# EasyEDA Pro project C题视觉追踪板子1.eprj, schematic Schematic1
Board Name: Board1; Create Date: 2025-04-08; Page Name: P1; Project Name: C题视觉追踪板子1; Schematic Name: Schematic1; Update Date: 2025-04-08; Company: 嘉立创EDA; Page Size: A4; Version: V1.0
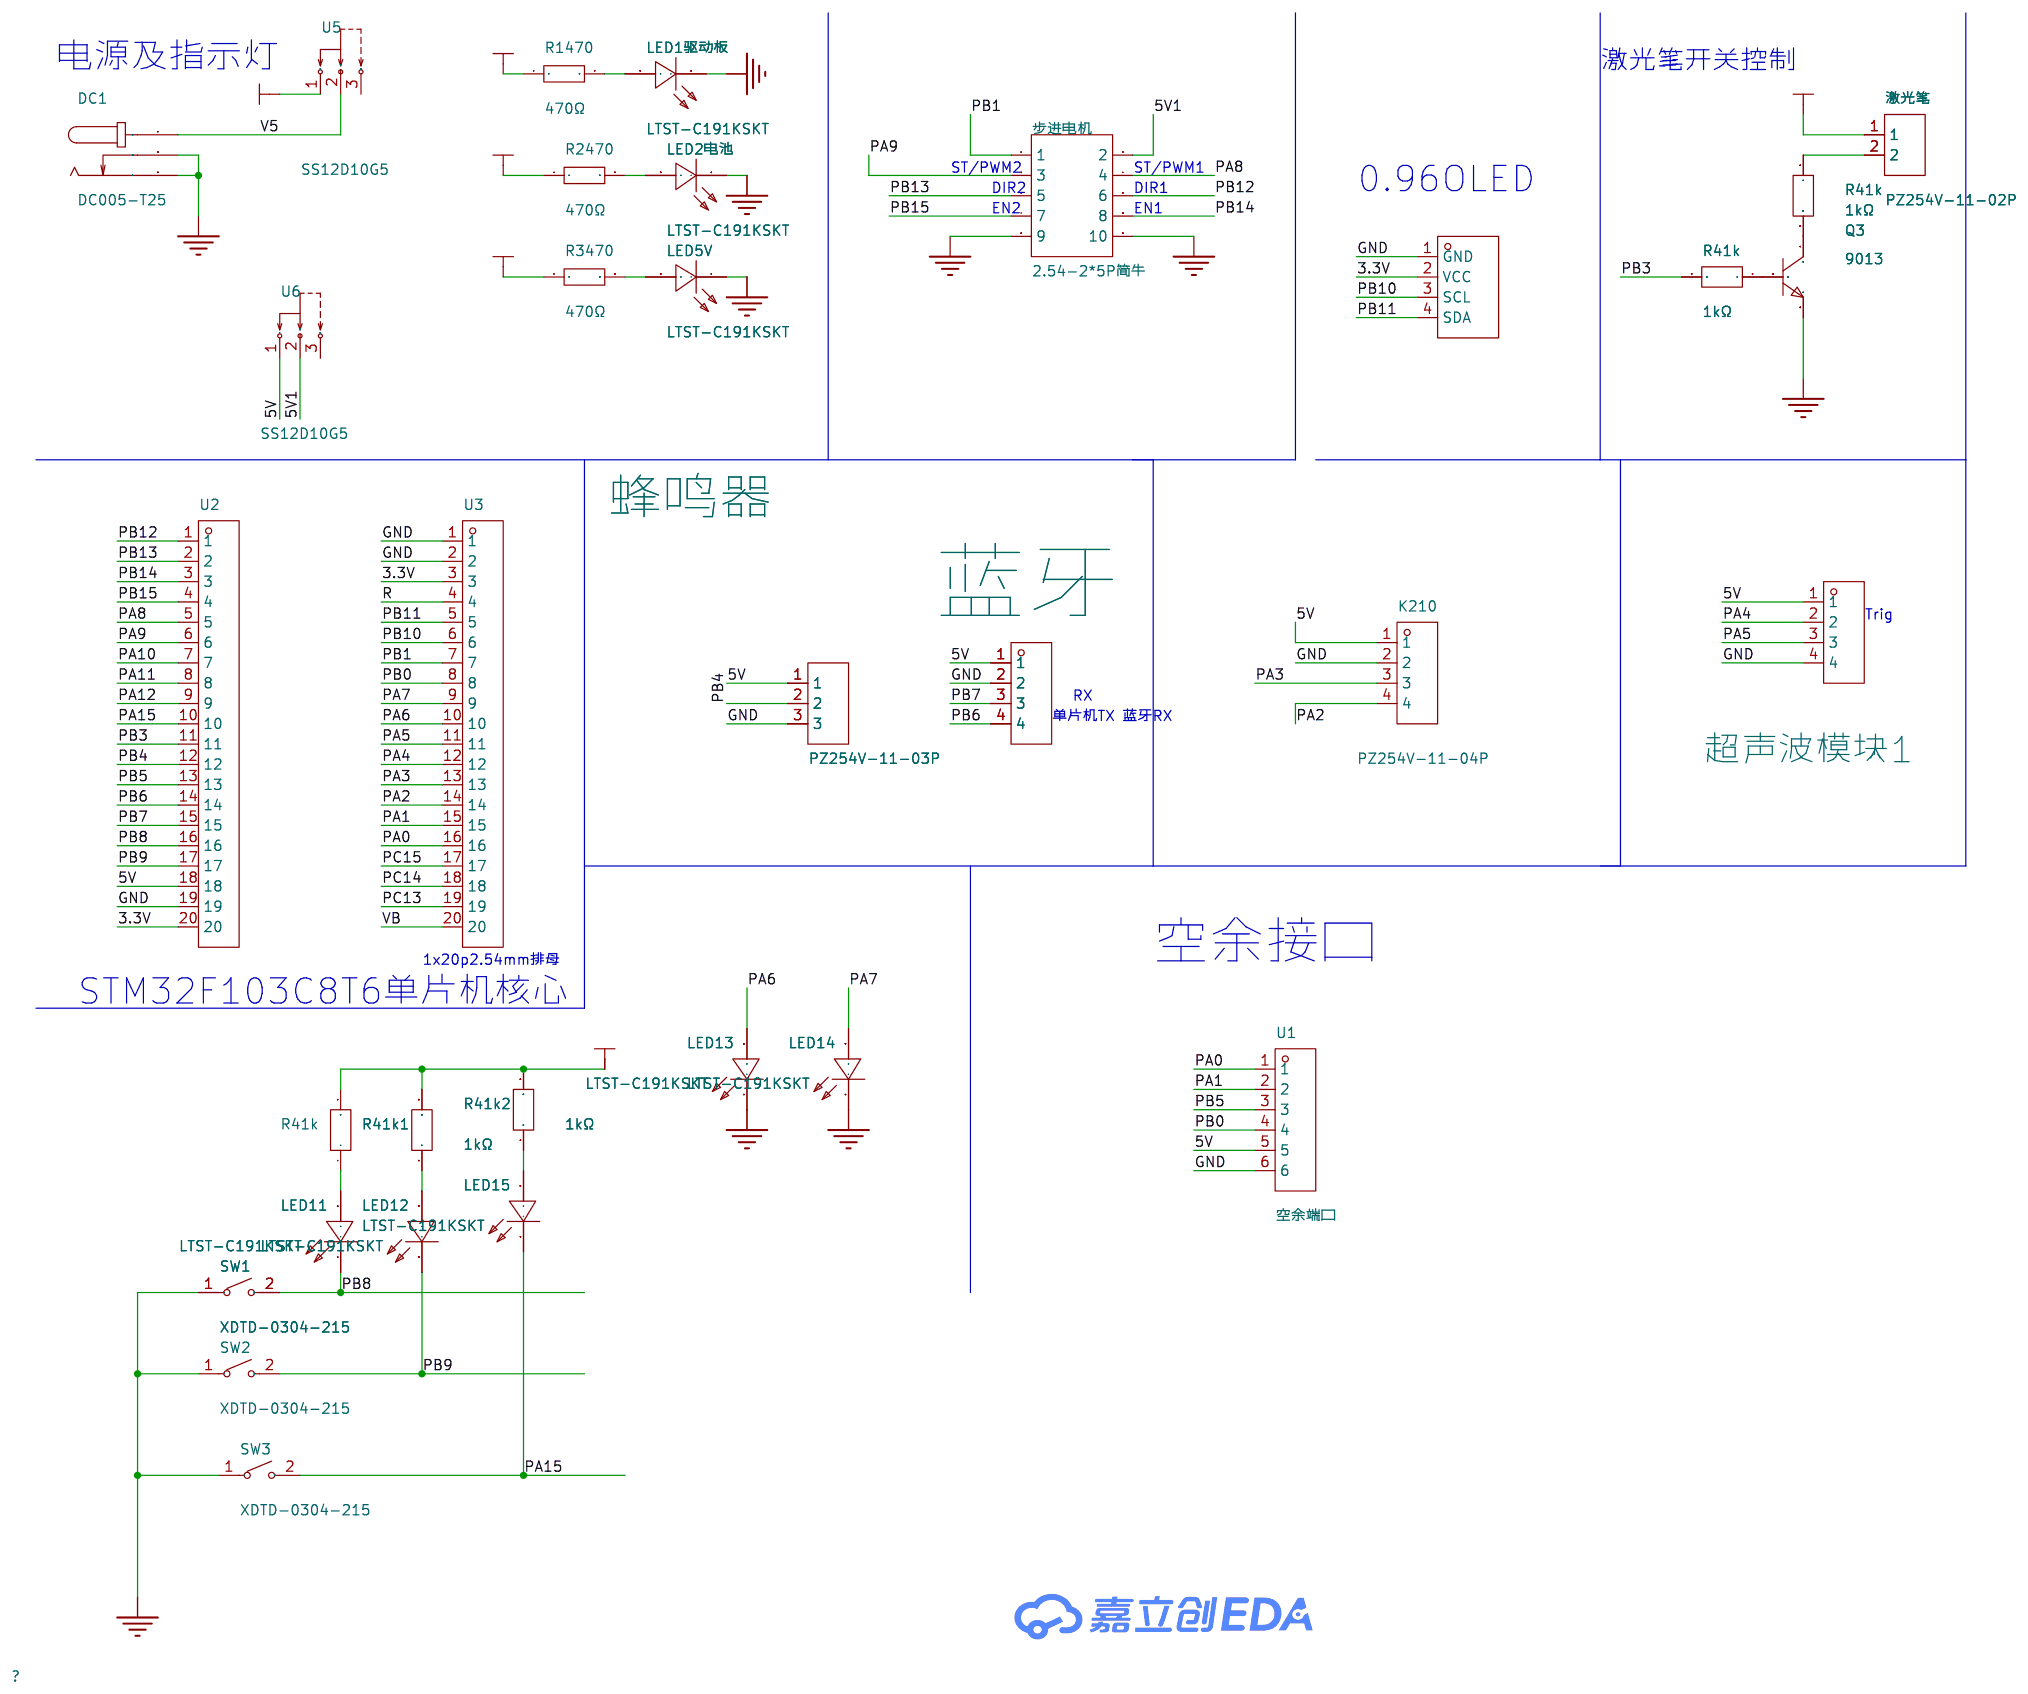
[diagram p0: schematic sheet]

## Parts
DC1  DC005-T25  [DC-IN-TH_DC-005-20A-1]
K210  PZ254V-11-04P  [HDR-TH_4P-P2.54-V-M]
LED1驱动板  LTST-C191KSKT  [LED0603-RD-YELLOW]
LED2电池  LTST-C191KSKT  [LED0603-RD-YELLOW]
LED5V  LTST-C191KSKT  [LED0603-RD-YELLOW]
LED11  LTST-C191KSKT  [LED0603-RD-YELLOW]
LED12  LTST-C191KSKT  [LED0603-RD-YELLOW]
LED13  LTST-C191KSKT  [LED0603-RD-YELLOW]
LED14  LTST-C191KSKT  [LED0603-RD-YELLOW]
LED15  LTST-C191KSKT  [LED0603-RD-YELLOW]
OLED1  HS96L03W2C03  [OLED-TH_L27.8-W27.2-P2.54_C9900033791]
Q3  9013  [TO-92-3_L4.8-W3.7-P2.54-R]
R41k  1kΩ  [RES-TH_BD2.3-L6.5-P10.50-D0.5]
R41k1  1kΩ  [R0603]
R41k2  1kΩ  [R0603]
R41k#2  1kΩ  [RES-TH_BD2.3-L6.5-P10.50-D0.5]
R41k#3  1kΩ  [R0603]
R1470  470Ω  [R0603]
R2470  470Ω  [R0603]
R3470  470Ω  [R0603]
SW1  XDTD-0304-215  [SW-SMD_L3.9-W3.0-P4.45]
SW2  XDTD-0304-215  [SW-SMD_L3.9-W3.0-P4.45]
SW3  XDTD-0304-215  [SW-SMD_L3.9-W3.0-P4.45]
U1  空余端口  [HDR-TH_6P-P2.54-V-F]
U2  KH-2FH-1X20P-H4.3  [hdr-th_20p-p2.54-v-f]
U3  KH-2FH-1X20P-H4.3  [hdr-th_20p-p2.54-v-f]
U5  SS12D10G5  [SW-TH_SHOU-HAN_SS12D10G4]
U6  SS12D10G5  [SW-TH_SHOU-HAN_SS12D10G4]
步进电机  2.54-2*5P简牛  [IDC-TH_10P-P2.54_C5665]
激光笔  PZ254V-11-02P  [HDR-TH_2P-P2.54-V-M]
蓝牙  2.54-1*4P母  [HDR-TH_4P-P2.54-V-F]
蜂鸣器  PZ254V-11-03P  [HDR-TH_3P-P2.54-V-M]
超声波模块1  KH-2.54FH-1X4P-H8.5  [HDR-TH_4P-P2.54-V-F]

## Library data of the parts
DC1 = DC005-T25: 触点内径:2.5mm;触点外径:6.3mm;额定电流:-;额定电压:-;; LCSC Part Name: 内径:2.5mm 外径:6.3mm; Supplier Part: C111573; Manufacturer: SOFNG(硕方); Supplier Footprint: 插件; JLCPCB Part Class: 扩展库; Datasheet: https://atta.szlcsc.com/upload/public/pdf/source/20211217/AAF92010038535095742900872F779AE.pdf; Supplier: LCSC; Inside Contact Diameter: 2.5mm; Outside Contact Diameter: 6.3mm
K210 = PZ254V-11-04P: 插针结构:1x4P;间距:2.54mm;行距:-;圆针/方针:方针;安装类型:直插;排数:单排;总PIN位数:4P;额定电流:3A;额定电压:250V;配合针长度:6mm;塑高:2.5mm;端接针长度:3mm;触头材质:-;工作温度范围:-40℃~+105℃;颜色:黑色;; LCSC Part Name: 间距:2.54mm 1x4P 直插 方针; Supplier Part: C2691448; Manufacturer: XFCN(兴飞); Supplier Footprint: 插件,P=2.54mm; JLCPCB Part Class: 扩展库; Datasheet: https://atta.szlcsc.com/upload/public/pdf/source/20200309/C492403_F9F19131791D08044AD4F84F8E751A34.pdf; Supplier: LCSC; Pin Structure: 1x4P; Pitch: 2.54mm; Circluar Pins/Square Pins: 方针; Mounting Type: 直插; Number of Rows: 单排; Number of Pins: 4P; Current Rating (Max): 3A; Voltage Rating (Max): 250V; Length of Mating Pin: 6mm; Insulation Height: 2.5mm; Length of End Connection Pin: 3mm; Operating Temperature Range: -40℃~+105℃; Color: 黑色
LED1驱动板 LED2电池 LED5V LED11-LED15 = LTST-C191KSKT: 发光颜色:黄色;正向电压(VF):2.1V;功率:75mW;正向电流:20mA;主波长:584.5nm~597nm;二极管配置:-;透镜颜色:无色透明透镜;色温:-;发光强度:104mcd;发光角度:130°;载带方式:-;工作温度:-55℃~+85℃;; LCSC Part Name: 黄灯; Supplier Part: C125100; Manufacturer: LITEON(光宝); Supplier Footprint: 0603; JLCPCB Part Class: 扩展库; Datasheet: https://atta.szlcsc.com/upload/public/pdf/source/20180129/C125100_15171877314981315871.pdf; Supplier: LCSC; Emitted Color: 黄色; Forward Voltage (VF): 2.1V; Power Dissipation: 75mW; Forward Current: 20mA; Dominant Wavelength: 584.5nm~597nm; Peak Wavelength: 588nm; Lens Color: 无色透明透镜; Luminous Intensity: 104mcd; Viewing Angle: 130°; Operating Temperature: -55℃~+85℃
OLED1 = HS96L03W2C03: 主控芯片:SSD1315;接口类型:I2C;尺寸(inch):0.96;像素分辨率:128x64;; LCSC Part Name: 0.96寸OLED显示屏窄白光IIC; Supplier Part: C5248080; Manufacturer: HS(汉昇); JLCPCB Part Class: 扩展库; Datasheet: https://atta.szlcsc.com/upload/public/pdf/source/20230627/763D01F79A90007632F098068C7C8AD9.pdf; Supplier: LCSC; Main Control Chip: SSD1315; Interface Type: I2C; Size: 0.96; Pixel Resolution: 128x64; Operating Temperature: -40℃~+70℃
Q3 = 9013: 晶体管类型:NPN;集电极电流(Ic):500mA;集射极击穿电压(Vceo):20V;功率(Pd):625mW;; LCSC Part Name: NPN 电流:500mA 耐压:20V; Supplier Part: C3037603; Manufacturer: BLUE ROCKET(蓝箭); Supplier Footprint: TO-92-2.54mm; JLCPCB Part Class: 扩展库; Supplier: LCSC; Transistor Type: NPN; Collector Current (Ic): 500mA; Collector-Emitter Breakdown Voltage (Vceo): 20V; Power Dissipation (Pd): 625mW; Collector Cut-Off Current (Icbo): 100nA
R41k R41k#2 = MF1/4W-1KΩ±1%T52: 电阻类型:金属膜电阻;阻值:1kΩ;精度:±1%;功率:250mW;温度系数:±200ppm/℃;; LCSC Part Name: 金属膜电阻 1kΩ ±1% 250mW; Supplier Part: C713997; Manufacturer: 华星机电; Supplier Footprint: 插件; JLCPCB Part Class: 扩展库; Datasheet: https://atta.szlcsc.com/upload/public/pdf/source/20200731/C713882_AE8EB1102749D7E4FB4FB13DC898C429.pdf; Supplier: LCSC; Type: 金属膜电阻; Tolerance: ±1%; Power(Watts): 250mW; Temperature Coefficient: ±200ppm/℃
R41k1 R41k2 R41k#3 = FCR0603F1K: 电阻类型:厚膜电阻;阻值:1kΩ;精度:±1%;功率:100mW;最大工作电压:75V;; LCSC Part Name: 1K ±1%; Supplier Part: C5913168; Manufacturer: VO(翔胜); Supplier Footprint: 0603; JLCPCB Part Class: 扩展库; Datasheet: https://atta.szlcsc.com/upload/public/pdf/source/20230428/98B65D379E9BA4CF2A9223D1647B01B6.pdf; Supplier: LCSC; Type: 厚膜电阻; Tolerance: ±1%; Power(Watts): 100mW; Overload Voltage (Max): 75V; Operating Temperature Range: -55℃~+155℃
R1470 R2470 R3470 = 0603WAF4700T5E: 电阻类型:厚膜电阻;阻值:470Ω;精度:±1%;功率:100mW;最大工作电压:75V;温度系数:±100ppm/℃;; LCSC Part Name: 470Ω ±1% 100mW 厚膜电阻; Supplier Part: C23179; Manufacturer: UNI-ROYAL(厚声); Supplier Footprint: 0603; JLCPCB Part Class: 基础库; Datasheet: https://atta.szlcsc.com/upload/public/pdf/source/20200306/C422600_1E6D84923E4A46A82E41ADD87F860B5C.pdf; Supplier: LCSC; Type: 厚膜电阻; Tolerance: ±1%; Power(Watts): 100mW; Overload Voltage (Max): 75V; Temperature Coefficient: ±100ppm/℃; Operating Temperature Range: -55℃~+155℃
SW1-SW3 = XDTD-0304-215: 电路结构:单刀单掷;按钮形状:-;作用力:-;安装方式:卧贴;开关高度:2mm;带支架:不带支架;触点电流:50mA;额定电压:250V;带灯:无;机械寿命:5万次;; LCSC Part Name: 轻触开关3*4*2H 贴板式; Supplier Part: C7498203; Manufacturer: LX(连欣科技); Supplier Footprint: SMD; JLCPCB Part Class: 扩展库; Datasheet: https://atta.szlcsc.com/upload/public/pdf/source/20230925/E06549ACD16FE2F3DB4E420CF8DEE249.pdf; Supplier: LCSC; Circuit: 单刀单掷; Mounting Style: 卧贴; Switch Height: 2mm; Strike Gundam: 不带支架; Contact Current: 50mA; Voltage Rating: 250V; Actuator/Cap Color: 黑色; With Lamp: 无; Mechanical Life: 5万次; Operating Temperature: -45℃~+80℃
U1 = 2.54-1*6P母: LCSC Part Name: 间距:2.54mm 1x6P 直插; Supplier Part: C40877; Manufacturer: BOOMELE(博穆精密); Supplier Footprint: 插件,P=2.54mm; JLCPCB Part Class: 扩展库; Datasheet: https://atta.szlcsc.com/upload/public/pdf/source/20210301/C2718488_F4427B881E42CAA8DDB0B1C12B3A522C.pdf; Supplier: LCSC; Holes Structure: 1x6P; Pitch: 2.54mm; Mounting Type: 直插; Number of Rows: 单排; Number of Holes: 6P
U2 U3 = KH-2FH-1X20P-H4.3: 插孔结构:1x20P;间距:2mm;行距:-;圆孔/方孔:方孔;安装类型:直插;排数:单排;总孔位数:20P;额定电流:1.5A;额定电压:-;插孔方向:顶部;塑高:4.3mm;工作温度范围:-40℃~+105℃;; LCSC Part Name: 间距:2mm 1x20P 直插; Supplier Part: C2938439; Manufacturer: kinghelm(金航标); Supplier Footprint: 插件,P=2mm; JLCPCB Part Class: 扩展库; Datasheet: https://atta.szlcsc.com/upload/public/pdf/source/20211228/5EC70B7FC510D3D80A3799409C3607F1.pdf; Supplier: LCSC; Holes Structure: 1x20P; Pitch: 2mm; Circular Hole / Square Hole: 方孔; Mounting Type: 直插; Number of Rows: 单排; Number of Holes: 20P; Current Rating (Max): 1.5A; Holes Direction: 顶部; Insulation Height: 4.3mm; Operating Temperature Range: -40℃~+105℃
U5 U6 = SS12D10G5: 电路结构:单刀双掷;安装方式:直插;额定电流(DC):2A;额定电压(DC):125V;机械寿命:3千次;; LCSC Part Name: 两档立式插件 3脚拨动开关 柄长5.0mm; Supplier Part: C7431054; Manufacturer: SHOU HAN(首韩); Supplier Footprint: 插件; JLCPCB Part Class: 扩展库; Datasheet: https://atta.szlcsc.com/upload/public/pdf/source/20231130/7A3DB6A149BF0A1DCFFE64FFC07FE434.pdf; Supplier: LCSC; Circuit: 单刀双掷; Switch Length: 12.7mm; Switch Width: 6.7mm; Mounting Style: 直插; Current Rating (DC): 2A; Voltage Rating (DC): 125V; Mechanical Life: 3千次; Operating Temperature: -25℃~+70℃
步进电机 = 2.54-2*5P简牛: 连接器类型:简牛座;间距:2.54mm;结构:2x5P;封装形式:直插;行距:2.54mm;排数:2;每排PIN数:5;触头材质:-;触头镀层:-;; LCSC Part Name: 2.54mm 2x5P 排数:2 每排P数:5; Supplier Part: C5665; Manufacturer: BOOMELE(博穆精密); Supplier Footprint: 插件,P=2.54mm; JLCPCB Part Class: 扩展库; Datasheet: https://atta.szlcsc.com/upload/public/pdf/source/20140331/1457707037896.pdf; Supplier: LCSC; Connector Type: 简牛座; Pitch: 2.54mm; Structure: 2x5P; Holder Type: 直插; Row Spacing: 2.54mm; Number of Rows: 2; Pin Number in each Row: 5
激光笔 = PZ254V-11-02P: 插针结构:1x2P;间距:2.54mm;行距:-;圆针/方针:方针;安装方式:直插;排数:单排;总PIN位数:2P;额定电流:-;额定电压:-;配合针长度:6mm;塑高:2.5mm;端接针长度:3mm;触头材质:黄铜;触头镀层:-;工作温度:-40℃~+105℃;颜色:黑色;; LCSC Part Name: 1x2P 间距:2.54mm 方针 直插; Supplier Part: C492401; Manufacturer: XFCN(兴飞); Supplier Footprint: 插件,P=2.54mm; JLCPCB Part Class: 扩展库; Datasheet: https://atta.szlcsc.com/upload/public/pdf/source/20200309/C492401_A812433581A9B211A7FFA413ADDFF0E5.pdf; Supplier: LCSC; Pin Structure: 1x2P; Pitch: 2.54mm; Circluar Pins/Square Pins: 方针; Mounting Type: 直插; Number of Rows: 单排; Number of Pins: 2P; Length of Mating Pin: 6mm; Insulation Height: 2.5mm; Length of End Connection Pin: 3mm; Contact Material: 黄铜; Operating Temperature: -40℃~+105℃; Color: 黑色
蓝牙 = 2.54-1*4P母: 插孔结构:1x4P;间距:2.54mm;行距:-;圆孔/方孔:方孔;安装类型:直插;排数:单排;总孔位数:4P;额定电流:3A;额定电压:-;插孔方向:顶部;塑高:-;触头材质:青铜;触头镀层:-;工作温度范围:-40℃~+105℃;焊接温度(最大值):-;; LCSC Part Name: 间距:2.54mm 1x4P 直插; Supplier Part: C2718488; Manufacturer: BOOMELE(博穆精密); Supplier Footprint: 插件,P=2.54mm; JLCPCB Part Class: 扩展库; Datasheet: https://atta.szlcsc.com/upload/public/pdf/source/20210301/C2718488_F4427B881E42CAA8DDB0B1C12B3A522C.pdf; Supplier: LCSC; Holes Structure: 1x4P; Pitch: 2.54mm; Circular Hole / Square Hole: 方孔; Mounting Type: 直插; Number of Rows: 单排; Number of Holes: 4P; Current Rating (Max): 3A; Holes Direction: 顶部; Contact Material: 青铜; Operating Temperature Range: -40℃~+105℃
蜂鸣器 = PZ254V-11-03P: 插针结构:1x3P;间距:2.54mm;行距:-;圆针/方针:方针;安装方式:直插;排数:单排;总PIN位数:3P;额定电流:3A;额定电压:250V;配合针长度:6mm;塑高:2.5mm;端接针长度:3mm;工作温度:-40℃~+105℃;颜色:黑色;; LCSC Part Name: 1x3P 间距:2.54mm 方针 直插; Supplier Part: C2937625; Manufacturer: XFCN(兴飞); Supplier Footprint: 插件,P=2.54mm; JLCPCB Part Class: 扩展库; Datasheet: https://atta.szlcsc.com/upload/public/pdf/source/20200309/C492402_8335C3D49C4E4C618838D59BB1D024C1.pdf; Supplier: LCSC; Pin Structure: 1x3P; Pitch: 2.54mm; Circluar Pins/Square Pins: 方针; Mounting Type: 直插; Number of Rows: 单排; Number of Pins: 3P; Current Rating: 3A; Voltage Rating (Max): 250V; Length of Mating Pin: 6mm; Insulation Height: 2.5mm; Length of End Connection Pin: 3mm; Operating Temperature: -40℃~+105℃; Color: 黑色
超声波模块1 = KH-2.54FH-1X4P-H8.5: 插孔结构:1x4P;间距:2.54mm;行距:-;圆孔/方孔:方孔;安装类型:直插;排数:单排;总孔位数:4P;额定电流:3A;额定电压:-;插孔方向:顶部;塑高:8.5mm;工作温度范围:-40℃~+105℃;; LCSC Part Name: 间距:2.54mm 1x4P 直插; Supplier Part: C2905415; Manufacturer: kinghelm(金航标); Supplier Footprint: 插件,P=2.54mm; JLCPCB Part Class: 扩展库; Datasheet: https://atta.szlcsc.com/upload/public/pdf/source/20211019/F01742C8B89DCA4810A857CC894DA6D1.pdf; Supplier: LCSC; Holes Structure: 1x4P; Pitch: 2.54mm; Circular Hole / Square Hole: 方孔; Mounting Type: 直插; Number of Rows: 单排; Number of Holes: 4P; Current Rating (Max): 3A; Holes Direction: 顶部; Insulation Height: 8.5mm; Operating Temperature Range: -40℃~+105℃

## Nets
3.3V: OLED1.2(VCC) R41k1.2 R41k2.2 R41k#3.2 U2.20 U3.3
5V: K210.1 R3470.1 U1.5 U2.18 U5.1 U6.1 激光笔.1 蓝牙.1 蜂鸣器.1 超声波模块1.1
5V1: R1470.1 U6.2 步进电机.2
GND: DC1.2 DC1.3 K210.2 LED1驱动板.1(-) LED2电池.1(-) LED5V.1(-) LED13.1(-) LED14.1(-) OLED1.1(GND) Q3.3(E) SW1.1 SW2.1 SW3.1 U1.6 U2.19 U3.1 U3.2 步进电机.9 步进电机.10 蓝牙.2 蜂鸣器.3 超声波模块1.4
V5: DC1.1 R2470.1 U5.2
PA0: U1.1 U3.16
PA1: U1.2 U3.15
PA2: K210.4 U3.14
PA3: K210.3 U3.13
PA4: U3.12 超声波模块1.2
PA5: U3.11 超声波模块1.3
PA6: LED13.2(+) U3.10
PA7: LED14.2(+) U3.9
PA8: U2.5 步进电机.4
PA9: U2.6 步进电机.3
PA10: U2.7
PA11: U2.8
PA12: U2.9
PA15: LED15.1(-) SW3.2 U2.10
PB0: U1.4 U3.8
PB1: U3.7 步进电机.1
PB3: R41k.2 U2.11
PB4: U2.12 蜂鸣器.2
PB5: U1.3 U2.13
PB6: U2.14 蓝牙.4
PB7: U2.15 蓝牙.3
PB8: LED11.1(-) SW1.2 U2.16
PB9: LED12.1(-) SW2.2 U2.17
PB10: OLED1.3(SCL) U3.6
PB11: OLED1.4(SDA) U3.5
PB12: U2.1 步进电机.6
PB13: U2.2 步进电机.5
PB14: U2.3 步进电机.8
PB15: U2.4 步进电机.7
PC13: U3.19
PC14: U3.18
PC15: U3.17
R: U3.4
VB: U3.20
$1N953: LED2电池.2(+) R2470.2
$1N998: LED1驱动板.2(+) R1470.2
$1N1457: LED5V.2(+) R3470.2
$1N4750: LED12.2(+) R41k1.1
$1N6693: LED15.2(+) R41k2.1
Net-(LED11-2): LED11.2(+) R41k#3.1
Net-(Q3-1): Q3.1(C) R41k#2.2
Net-(Q3-2): Q3.2(B) R41k.1
Net-(R41k#2-1): R41k#2.1 激光笔.2

Not connected (* = marked no-connect by the designer): U5 3; U6 3

## Notes on the sheet
- 电源及指示灯
- 激光笔开关控制
- ST/PWM2
- ST/PWM1
- DIR2
- EN2
- DIR1
- EN1
- 0.96OLED
- Trig
- RX
- 单片机TX 蓝牙RX
- 1x20p2.54mm排母
- 空余接口
- STM32F103C8T6单片机核心
